# Altium project MSP430_GPRS_Test.PrjPCB
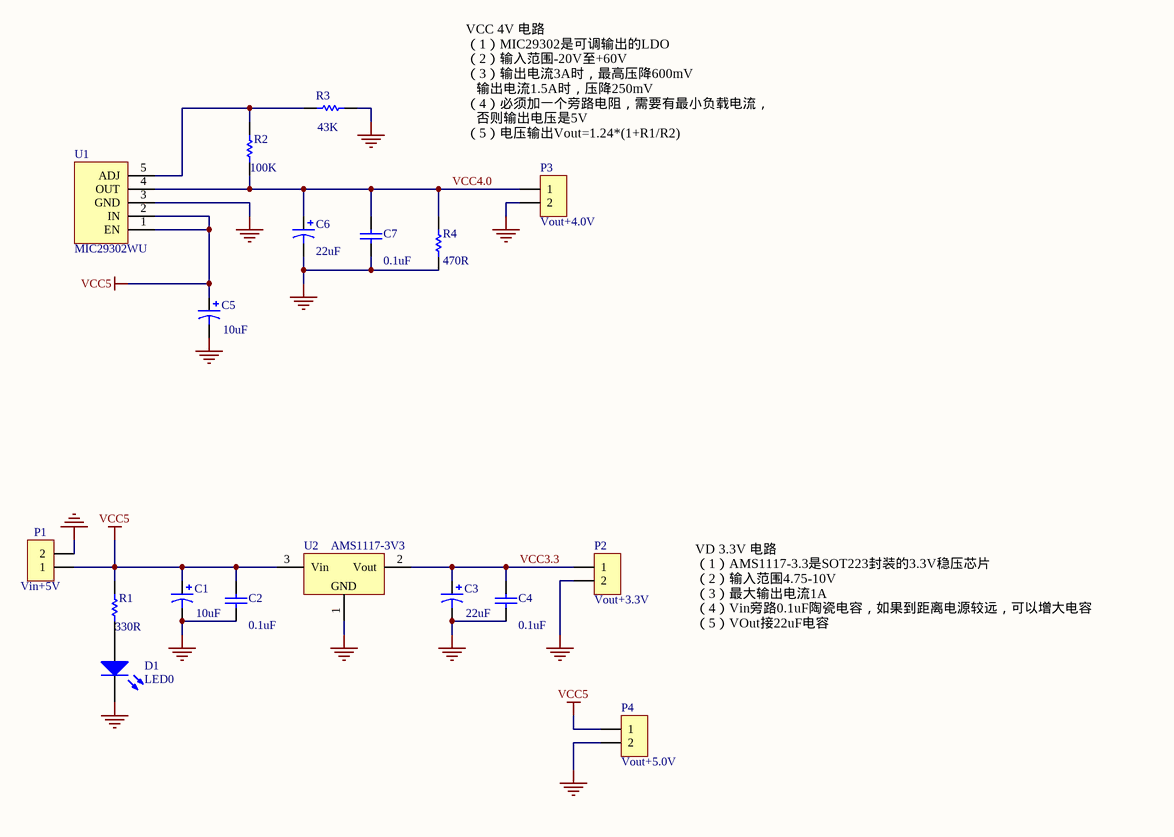
[diagram p0: Power.SchDoc]
2 sheets, 19 parts. Net scope: global (net labels, ports and power ports of the same name join across sheets).
Board files: Power1.PcbDoc, MSP430MCU1.PcbDoc
Sheets:
  Power.SchDoc
  MSP430MCU.SchDoc

## Sheet Power.SchDoc: 电源电路
size A4

### Parts
C1  value 10uF  [CAP 2.0*5*11 - BK]  (hidden comment: Cap Pol1)
C2  value 0.1uF  [CC 2.2*5]  (hidden comment: Cap)
C3  value 22uF  [CAP 2.0*5*11 - BK]  (hidden comment: Cap Pol1)
C4  value 0.1uF  [CC 2.2*5]  (hidden comment: Cap)
C5  value 10uF  [CAP 2.0*5*11 - BK]  (hidden comment: Cap Pol1)
C6  value 22uF  [CAP 2.0*5*11 - BK]  (hidden comment: Cap Pol1)
C7  value 0.1uF  [CC 2.2*5]  (hidden comment: Cap)
D1  LED0  [LED 3MM-R]
P1  Vin+5V  [XH2.54-2P]
P2  Vout+3.3V  [XH2.54-2P]
P3  Vout+4.0V  [XH2.54-2P]
P4  Vout+5.0V  [XH2.54-2P]
R1  value 330R  [RS 1/4W]  (hidden comment: Res1)
R2  value 100K  [RS 1/4W]  (hidden comment: Res1)
R3  value 43K  [RS 1/4W]  (hidden comment: Res1)
R4  value 470R  [RS 1/4W]  (hidden comment: Res1)
U1  MIC29302WU  [TO263-5]
U2  AMS1117-3V3  [SOT223_M]

### Nets
GND: C1.2 C2.1 C3.2 C4.1 C5.2 C6.2 C7.1 D1.2(K) P1.2 P2.2 P3.2 P4.2 R3.1 R4.1 U1.3(GND) U2.1(GND)
VCC5: C1.1 C2.2 C5.1 P1.1 P4.1 R1.2 U1.1(EN) U1.2(IN) U2.3(Vin)
VCC3.3: C3.1 C4.2 P2.1 U2.2(Vout)
VCC4.0: C6.1 C7.2 P3.1 R2.1 R4.2 U1.4(OUT)
NetD1_1: D1.1(A) R1.1
NetR2_2: R2.2 R3.2 U1.5(ADJ)

### Notes on the sheet
- (near P3) VCC 4V 电路
  （1）MIC29302是可调输出的LDO
  （2）输入范围-20V至+60V
  （3）输出电流3A时，最高压降600mV
  输出电流1.5A时，压降250mV
  （4）必须加一个旁路电阻，需要有最小负载电流，
  否则输出电压是5V
  （5）电压输出Vout=1.24*(1+R1/R2)
- VD 3.3V 电路
  （1）AMS1117-3.3是SOT223封装的3.3V稳压芯片
  （2）输入范围4.75-10V
  （3）最大输出电流1A
  （4）Vin旁路0.1uF陶瓷电容，如果到距离电源较远，可以增大电容
  （5）VOut接22uF电容

### Library data of the parts
C1 C3 C5 C6 = Cap Pol1: Polarized Capacitor (Radial); Published: 8-Jun-2000; LatestRevisionDate: 17-Jul-2002; LatestRevisionNote: Re-released for DXP Platform.; PackageReference: RB7.6-15; Publisher: Altium Limited; PackageDescription: Polarized Capacitor (Radial); 2 Leads
C2 C4 C7 = Cap: Capacitor; Published: 8-Jun-2000; LatestRevisionDate: 17-Jul-2002; LatestRevisionNote: Re-released for DXP Platform.; PackageReference: RAD-0.3; Publisher: Altium Limited; PackageDescription: Radial Cap, Thru-Hole; 2 Leads; 0.3 in Pin Spacing
D1 = LED0: Typical INFRARED GaAs LED; Published: 8-Jun-2000; LatestRevisionDate: 08-Jul-2005; LatestRevisionNote: Mech Layer 1 removed.; PackageReference: LED-0; Publisher: Altium Limited; PackageDescription: LED; 2 Leads
P1-P4 = Header 2: 2P接插件; 版权归属: 源创客; BOM名称: 2P接插件; 学习资源: www.ooocke.com
R1-R4 = Res1: Resistor; Published: 8-Jun-2000; LatestRevisionDate: 17-Jul-2002; LatestRevisionNote: Re-released for DXP Platform.; PackageReference: AXIAL-0.3; Publisher: Altium Limited; PackageDescription: Axial Device, Thru-Hole; 2 Leads; 0.3 in Pin Spacing
U1 = MIC29302WU: 2A,  adjustable LDO
U2 = AMS1117: 三端稳压芯片; BOM名称: 稳压芯片; 版权归属: 源创客; 学习资源: www.ooocke.com

## Sheet MSP430MCU.SchDoc: MSP430MCU 电路
size A4
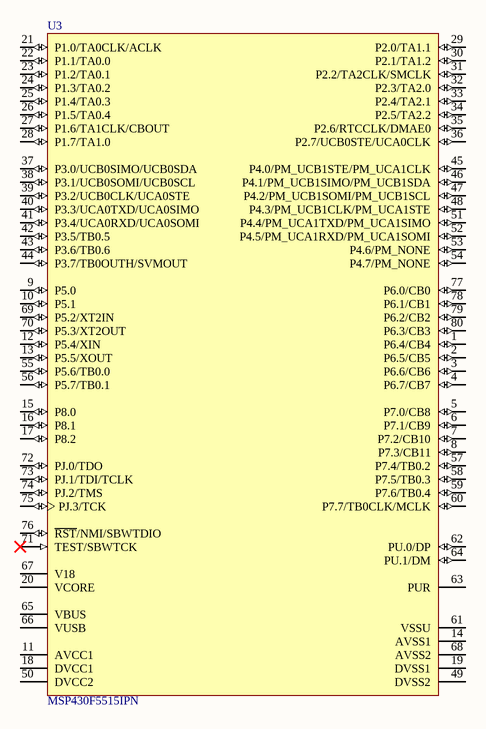
[diagram p1: MSP430MCU.SchDoc]

### Parts
U3  MSP430F5515IPN  [TI-PN80_N]

### Nets

Not connected (* = marked no-connect by the designer): U3 1(P6.4/CB4) 2(P6.5/CB5) 3(P6.6/CB6) 4(P6.7/CB7) 5(P7.0/CB8) 6(P7.1/CB9) 7(P7.2/CB10) 8(P7.3/CB11) 9(P5.0) 10(P5.1) 11(AVCC1) 12(P5.4/XIN) 13(P5.5/XOUT) 14(AVSS1) 15(P8.0) 16(P8.1) 17(P8.2) 18(DVCC1) 19(DVSS1) 20(VCORE) 21(P1.0/TA0CLK/ACLK) 22(P1.1/TA0.0) 23(P1.2/TA0.1) 24(P1.3/TA0.2) 25(P1.4/TA0.3) 26(P1.5/TA0.4) 27(P1.6/TA1CLK/CBOUT) 28(P1.7/TA1.0) 29(P2.0/TA1.1) 30(P2.1/TA1.2) 31(P2.2/TA2CLK/SMCLK) 32(P2.3/TA2.0) 33(P2.4/TA2.1) 34(P2.5/TA2.2) 35(P2.6/RTCCLK/DMAE0) 36(P2.7/UCB0STE/UCA0CLK) 37(P3.0/UCB0SIMO/UCB0SDA) 38(P3.1/UCB0SOMI/UCB0SCL) 39(P3.2/UCB0CLK/UCA0STE) 40(P3.3/UCA0TXD/UCA0SIMO) 41(P3.4/UCA0RXD/UCA0SOMI) 42(P3.5/TB0.5) 43(P3.6/TB0.6) 44(P3.7/TB0OUTH/SVMOUT) 45(P4.0/PM_UCB1STE/PM_UCA1CLK) 46(P4.1/PM_UCB1SIMO/PM_UCB1SDA) 47(P4.2/PM_UCB1SOMI/PM_UCB1SCL) 48(P4.3/PM_UCB1CLK/PM_UCA1STE) 49(DVSS2) 50(DVCC2) 51(P4.4/PM_UCA1TXD/PM_UCA1SIMO) 52(P4.5/PM_UCA1RXD/PM_UCA1SOMI) 53(P4.6/PM_NONE) 54(P4.7/PM_NONE) 55(P5.6/TB0.0) 56(P5.7/TB0.1) 57(P7.4/TB0.2) 58(P7.5/TB0.3) 59(P7.6/TB0.4) 60(P7.7/TB0CLK/MCLK) 61(VSSU) 62(PU.0/DP) 63(PUR) 64(PU.1/DM) 65(VBUS) 66(VUSB) 67(V18) 68(AVSS2) 69(P5.2/XT2IN) 70(P5.3/XT2OUT) 71(TEST/SBWTCK)* 72(PJ.0/TDO) 73(PJ.1/TDI/TCLK) 74(PJ.2/TMS) 75(PJ.3/TCK) 76(~{RST}/NMI/SBWTDIO) 77(P6.0/CB0) 78(P6.1/CB1) 79(P6.2/CB2) 80(P6.3/CB3)

### Library data of the parts
U3 = MSP430F5515IPN: 25 MHz Mixed Signal Microcontroller with 64 KB Flash, 4096 B SRAM and 63 GPIOs, -40 to 85 degC, 80-pin QFP (PN), Green (RoHS & no Sb/Br); Manufacturer: Texas Instruments; Brown Out Reset: Yes; DMA: 3; Flash(KB): 64; Frequency(MHz): 25; GPIO: 63; Multiplier: 32x32; SRAM(B): 4096; SubFamily: 5 Series; Timers - 16-bit: 4; USB: 1; USCI_A (UART/LIN/IrDA/SPI): 2; DatasheetVersion: SLAS590I; PackageReference: PN80; PackageDescription: 80-Pin Plastic Quad Flat Pack, Body 12 x 12 mm, Pitch 0.5 mm; Supplier 1: Digi-Key; Supplier Part Number 1: 296-27376-2-ND; Supplier 2: Digi-Key; Supplier Part Number 2: 296-27376-1-ND; Supplier 3: Digi-Key; Supplier Part Number 3: 296-27376-6-ND; Supplier 4: Newark; Supplier Part Number 4: 74R6462; Supplier 5: Mouser; Supplier Part Number 5: 595-MSP430F5514IZQER; Comparators: Yes; Eco-Plan: Green (RoHS & no Sb/Br); Real-Time Clock: Yes; SVS: Yes; USCI_B (I2C & SPI): 2; Watchdog: Yes; Mounting Technology: Surface Mount; Code_JEDEC: MS-018; PartNumber: MSP430F5515IPN; ComponentLink1Description: Manufacturer URL; ComponentLink1URL: http://www.ti.com/; ComponentLink2Description: Datasheet; ComponentLink2URL: http://www.ti.com/general/docs/lit/getliterature.tsp?genericPartNumber=MSP430F5515&fileType=pdf; ComponentLink3Description: Package Specification; ComponentLink3URL: http://www.ti.com/lit/ml/mtqf010a/mtqf010a.pdf